# EAGLE design Inter (EAGLE 7.5.0)
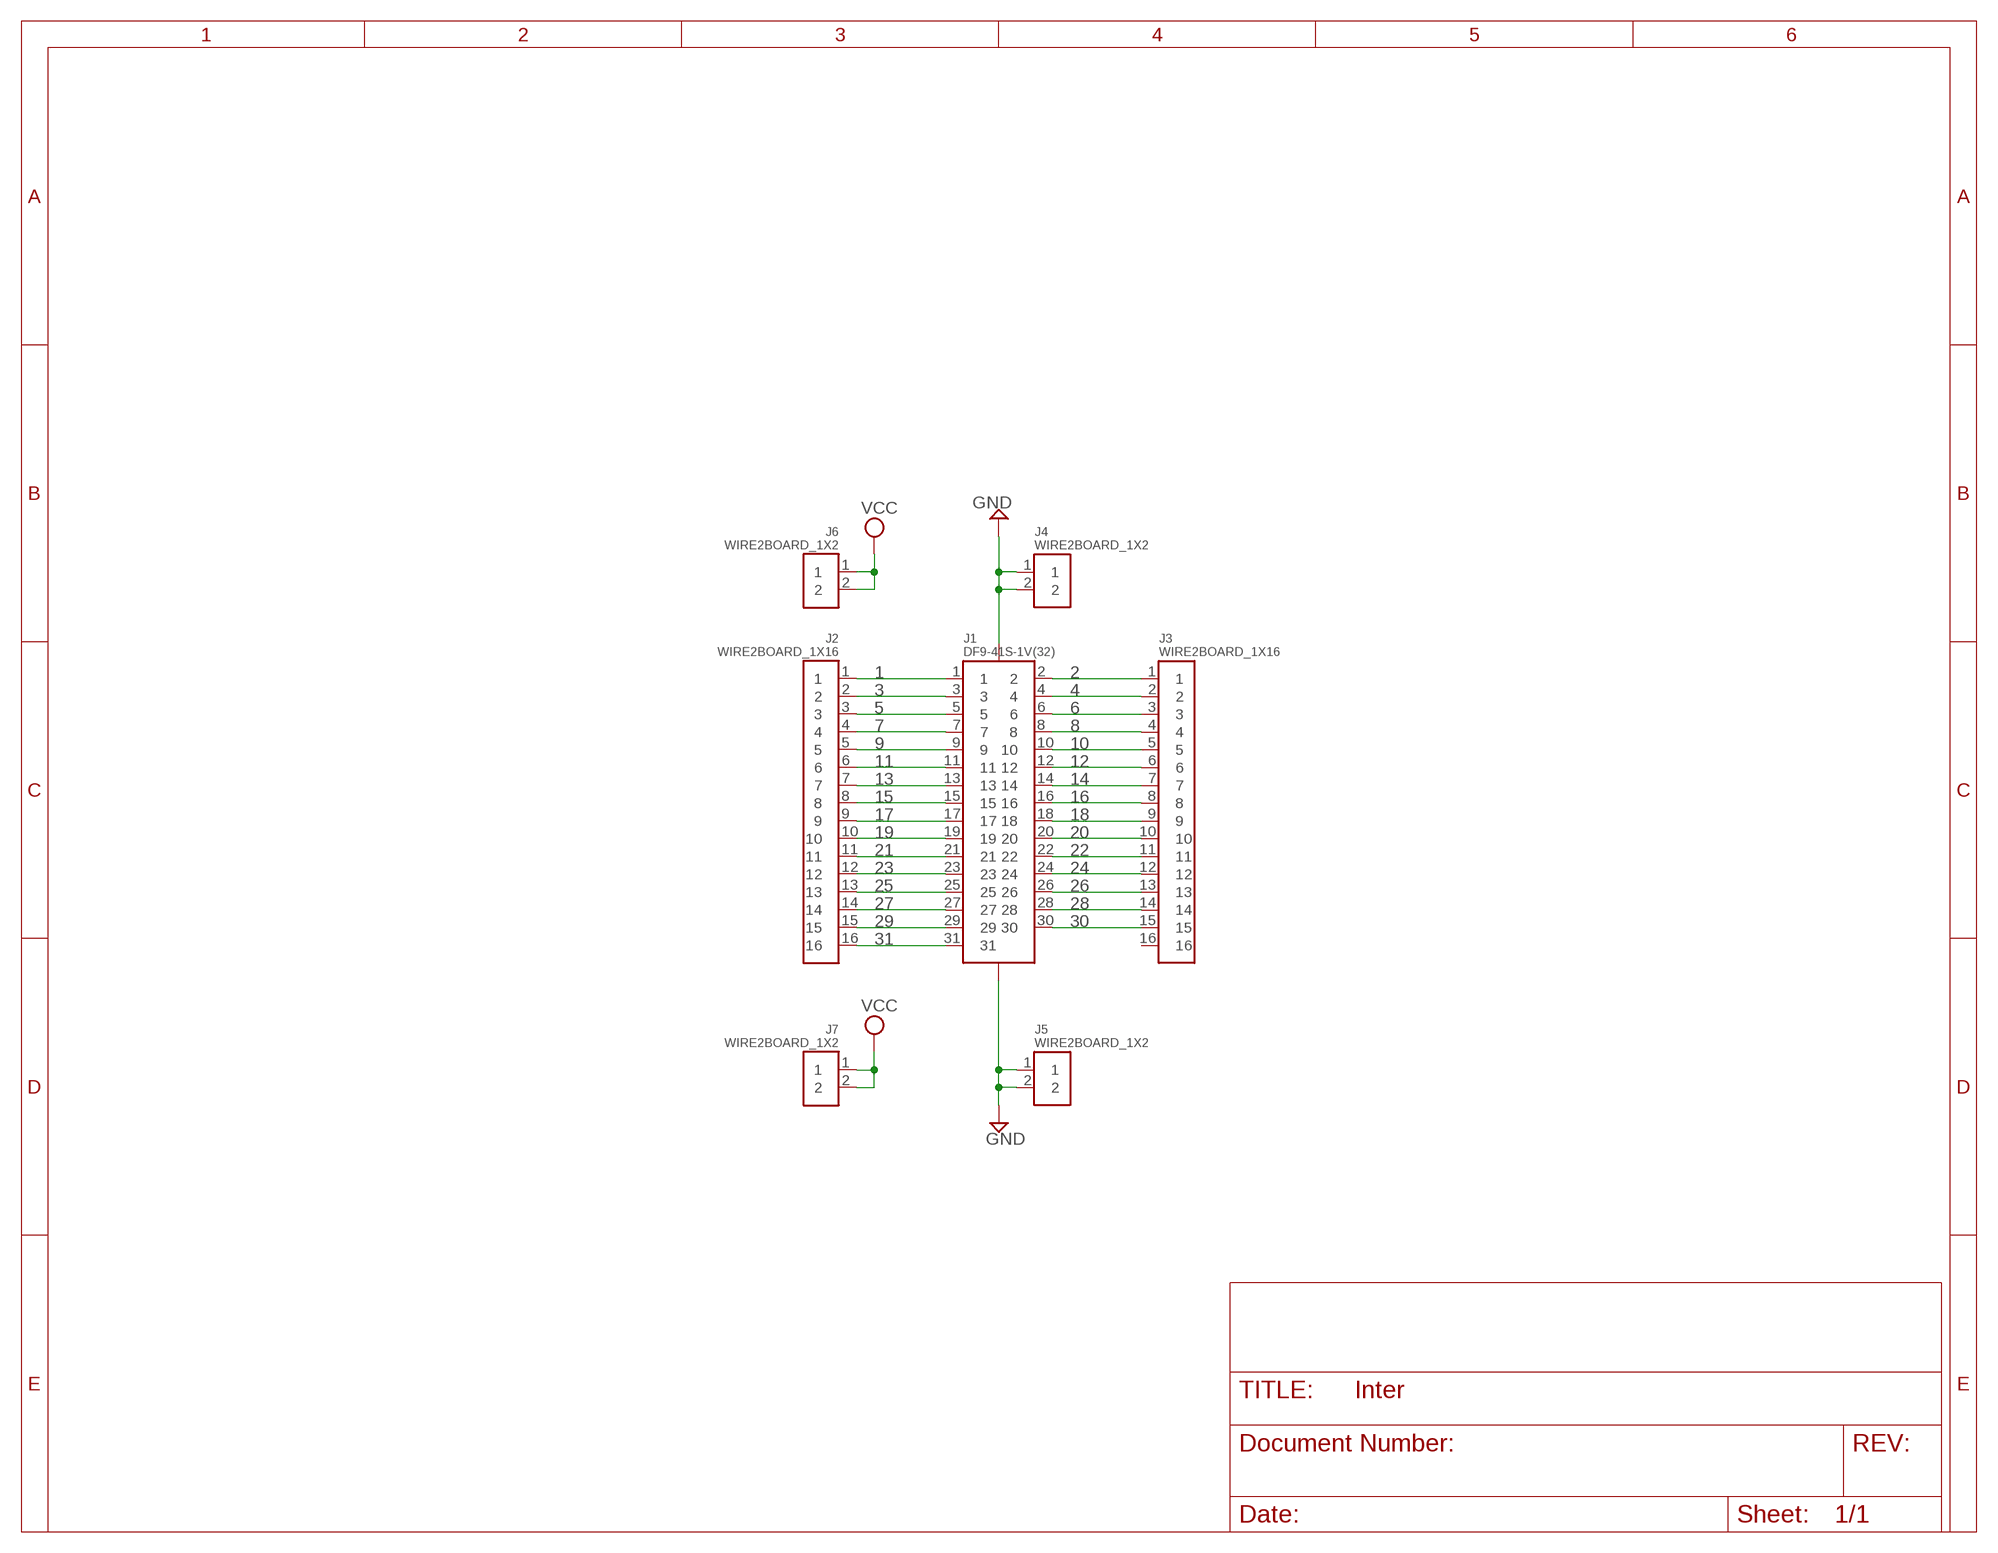
[diagram p0: schematic, sheet 1]

## Parts
J1  DF9-41S-1V(32)  [DF9-41S-1V(32)]
J2  WIRE2BOARD_1X16  [WIRE2BOARD_1X16]
J3  WIRE2BOARD_1X16  [WIRE2BOARD_1X16]
J4  WIRE2BOARD_1X2  [WIRE2BOARD_1X2]
J5  WIRE2BOARD_1X2  [WIRE2BOARD_1X2]
J6  WIRE2BOARD_1X2  [WIRE2BOARD_1X2]
J7  WIRE2BOARD_1X2  [WIRE2BOARD_1X2]

## Nets
1: J1.1 J2.1
2: J1.2 J3.1
3: J1.3 J2.2
4: J1.4 J3.2
5: J1.5 J2.3
6: J1.6 J3.3
7: J1.7 J2.4
8: J1.8 J3.4
9: J1.9 J2.5
10: J1.10 J3.5
11: J1.11 J2.6
12: J1.12 J3.6
13: J1.13 J2.7
14: J1.14 J3.7
15: J1.15 J2.8
16: J1.16 J3.8
17: J1.17 J2.9
18: J1.18 J3.9
19: J1.19 J2.10
20: J1.20 J3.10
21: J1.21 J2.11
22: J1.22 J3.11
23: J1.23 J2.12
24: J1.24 J3.12
25: J1.25 J2.13
26: J1.26 J3.13
27: J1.27 J2.14
28: J1.28 J3.14
29: J1.29 J2.15
30: J1.30 J3.15
31: J1.31 J2.16
GND: J1.32 J1.33 J4.1 J4.2 J5.1 J5.2
VCC: J6.1 J6.2 J7.1 J7.2
Unconnected: J3.16

## Library data of the parts
J1 = dsantoro-conn:DF9-41S-1V(32)
J2 J3 = dsantoro-conn:WIRE2BOARD_1X16
J4-J7 = dsantoro-conn:WIRE2BOARD_1X2

## Board
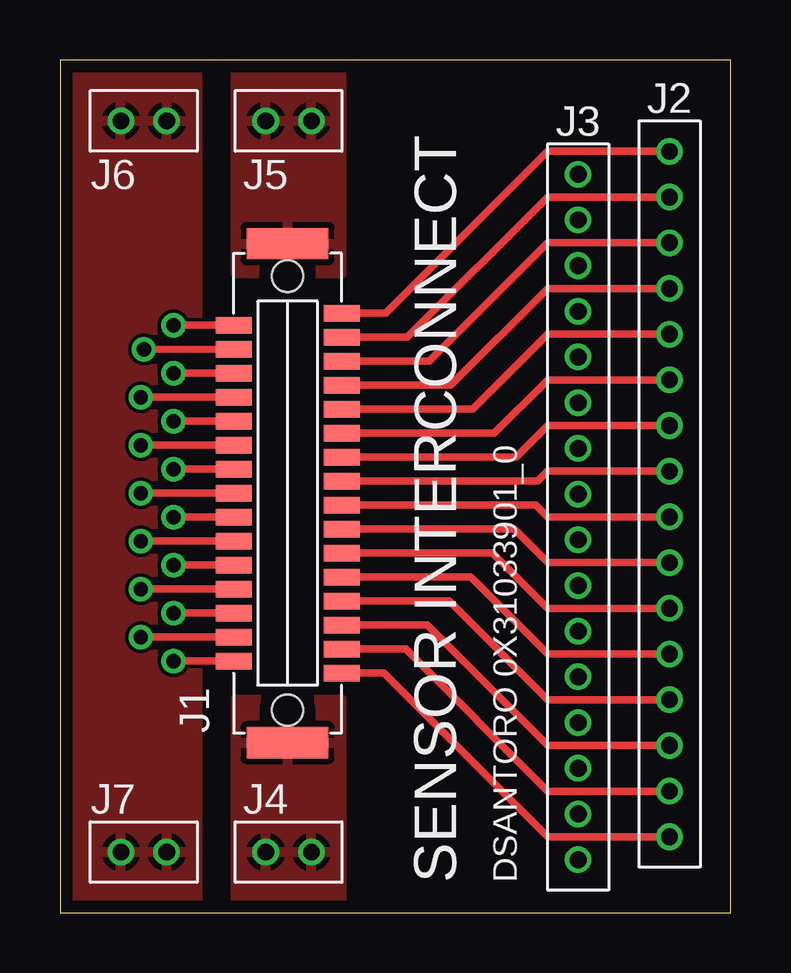
[diagram p1: board, top side]
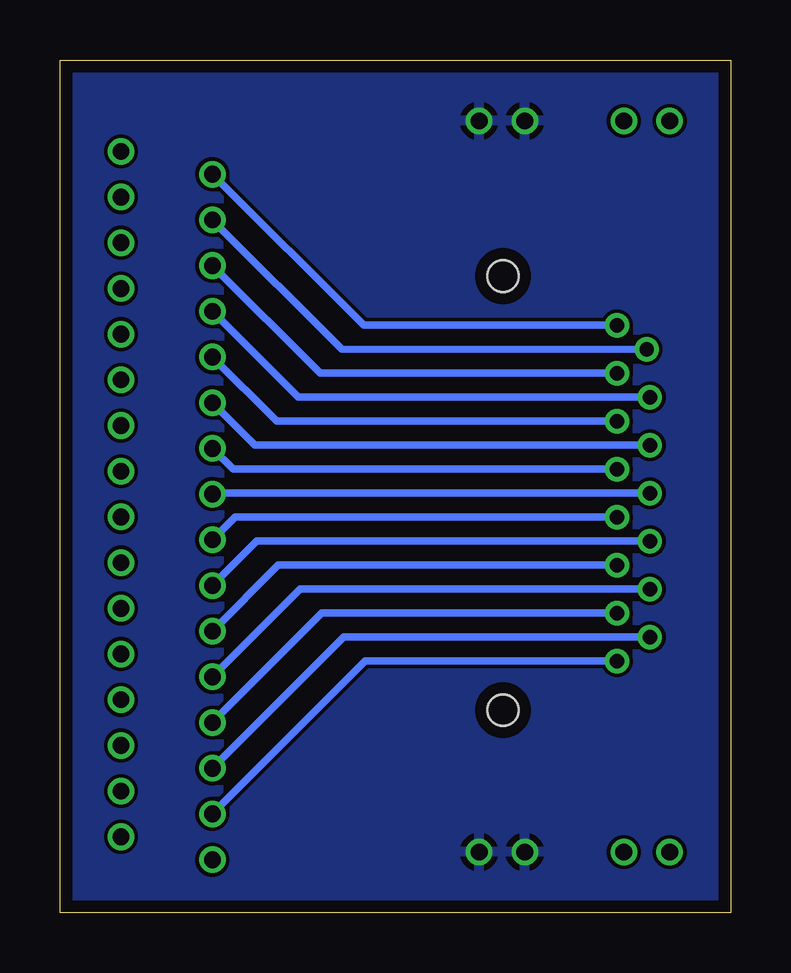
[diagram p2: board, bottom side, seen from below]

Size 27.94 x 35.56 mm. Coordinates in mm from the lower left corner, seen from the top.
Outline: 0,0 27.94,0 27.94,35.56 0,35.56 0,0
Copper layers (1*16): Top 0.0178mm / dielectric 59mil / Bottom 0.0178mm
Design rules "SSC-EAGLE-2Lyr_v1.0.0.3": minimum track width 6mil, minimum drill 14mil, track to track 6mil, track to pad 6mil, pad to pad 6mil, via to via 6mil, smd to smd 6mil, copper to edge 20mil, drill to drill 16mil, minimum pad ring 8mil, minimum via ring 8mil, stop-mask expansion 3mil, vias tented up to drill 0mil, thermal gap 10mil

### Footprints (pad centres in the part's own frame; a part is rotated, then mirrored left to right if it is on the bottom)
DF9-41S-1V(32) = smd 0.7 x 1.5: 1 15,0; 2 14.5,4.5; 3 14,0; 4 13.5,4.5; 5 13,0; 6 12.5,4.5; 7 12,0; 8 11.5,4.5; 9 11,0; 10 10.5,4.5; 11 10,0; 12 9.5,4.5; 13 9,0; 14 8.5,4.5; 15 8,0; 16 7.5,4.5; 17 7,0; 18 6.5,4.5; 19 6,0; 20 5.5,4.5; 21 5,0; 22 4.5,4.5; 23 4,0; 24 3.5,4.5; 25 3,0; 26 2.5,4.5; 27 2,0; 28 1.5,4.5; 29 1,0; 30 0.5,4.5; 31 0,0 | smd 1.3 x 3.4: 32 -2.9,2.25; 33 17.9,2.25 | hole 1.3: -1.55,2.25; 16.55,2.25
WIRE2BOARD_1X16 = drill 0.7: 1 0,0; 2 0,-1.905; 3 0,-3.81; 4 0,-5.715; 5 0,-7.62; 6 0,-9.525; 7 0,-11.43; 8 0,-13.335; 9 0,-15.24; 10 0,-17.145; 11 0,-19.05; 12 0,-20.955; 13 0,-22.86; 14 0,-24.765; 15 0,-26.67; 16 0,-28.575
WIRE2BOARD_1X2 = drill 0.7: 1 0,0; 2 0,-1.905

### Placement (x,y rotation side)
J1  11.73,10 90 top
J2  25.4,31.75 0 top
J3  21.59,30.8 0 top
J4  10.48,2.54 270 top
J5  10.48,33.02 270 top
J6  2.54,33.02 90 top
J7  4.45,2.54 270 top

### Tracks (layer width: path | path; a pad name or v marks a point on that pad's centre or on a via)
1
  Top 0.305: J2.1 20.32,31.75 13.57,25 J1.1
2  (via drill 0.6)
  Top 0.305: J1.2 v4.73,24.5
  Bottom 0.305: J3.1 15.29,24.5 v4.73,24.5
3
  Top 0.305: J2.2 20.32,29.84 14.47,24 J1.3
4  (via drill 0.6)
  Top 0.305: J1.4 v3.49,23.5
  Bottom 0.305: J3.2 16.2,23.5 v3.49,23.5
5
  Top 0.305: J2.3 20.32,27.94 15.38,23 J1.5
6  (via drill 0.6)
  Top 0.305: J1.6 v4.73,22.5
  Bottom 0.305: J3.3 17.1,22.5 v4.73,22.5
7
  Top 0.305: J2.4 20.32,26.04 16.29,22 J1.7
8  (via drill 0.6)
  Top 0.305: J1.8 v3.37,21.5
  Bottom 0.305: J3.4 18.01,21.5 v3.37,21.5
9
  Top 0.305: J2.5 20.32,24.13 17.19,21 J1.9
10  (via drill 0.6)
  Top 0.305: v4.73,20.5 J1.10
  Bottom 0.305: J3.5 18.91,20.5 v4.73,20.5
11
  Top 0.305: J2.6 20.32,22.23 18.09,20 J1.11
12  (via drill 0.6)
  Top 0.305: J1.12 v3.37,19.5
  Bottom 0.305: J3.6 19.82,19.5 v3.37,19.5
13
  Top 0.305: J2.7 20.32,20.32 19,19 J1.13
14  (via drill 0.6)
  Top 0.305: J1.14 v4.73,18.5
  Bottom 0.305: J3.7 20.72,18.5 v4.73,18.5
15
  Top 0.305: J2.8 20.32,18.41 19.91,18 J1.15
16  (via drill 0.6)
  Top 0.305: J1.16 v3.37,17.5
  Bottom 0.305: 21.55,17.5 v3.37,17.5
  Bottom 0.406: J3.8 21.55,17.5
17
  Top 0.305: J2.9 20.32,16.51 19.83,17 J1.17
18  (via drill 0.6)
  Top 0.305: J1.18 v4.73,16.5
  Bottom 0.305: J3.9 20.65,16.5 v4.73,16.5
19
  Top 0.305: J2.10 20.32,14.61 18.93,16 J1.19
20  (via drill 0.6)
  Top 0.305: J1.20 v3.37,15.5
  Bottom 0.305: J3.10 19.74,15.5 v3.37,15.5
21
  Top 0.305: J2.11 20.32,12.7 18.02,15 J1.21
22  (via drill 0.6)
  Top 0.305: J1.22 v4.73,14.5
  Bottom 0.305: J3.11 18.84,14.5 v4.73,14.5
23
  Top 0.305: J2.12 20.32,10.79 17.11,14 J1.23
24  (via drill 0.6)
  Top 0.305: J1.24 v3.37,13.5
  Bottom 0.305: J3.12 17.93,13.5 v3.37,13.5
25
  Top 0.305: J2.13 20.32,8.89 16.21,13 J1.25
26  (via drill 0.6)
  Top 0.305: J1.26 v4.73,12.5
  Bottom 0.305: J3.13 17.03,12.5 v4.73,12.5
27
  Top 0.305: J2.14 20.32,6.99 15.3,12 J1.27
28  (via drill 0.6)
  Top 0.305: J1.28 v3.37,11.5
  Bottom 0.305: J3.14 16.12,11.5 v3.37,11.5
29
  Top 0.305: J2.15 20.32,5.08 14.4,11 J1.29
30  (via drill 0.6)
  Top 0.305: J1.30 v4.73,10.5
  Bottom 0.305: J3.15 15.22,10.5 v4.73,10.5
31
  Top 0.305: J2.16 20.32,3.17 13.49,10 J1.31
GND
  pour Top: 11.75,26.67 11.75,35.56 7.3,35.56 7.3,26.67
  pour Top: 11.75,0 11.75,8.89 7.3,8.89 7.3,0
  pour Bottom: 0,35.56 27.94,35.56 27.94,0 0,0
VCC
  pour Top: 0,35.56 5.71,35.56 5.71,0 0,0

### Text on the board
tPlace: SENSOR INTERCONNECT | DSANTORO 0X31033901_0